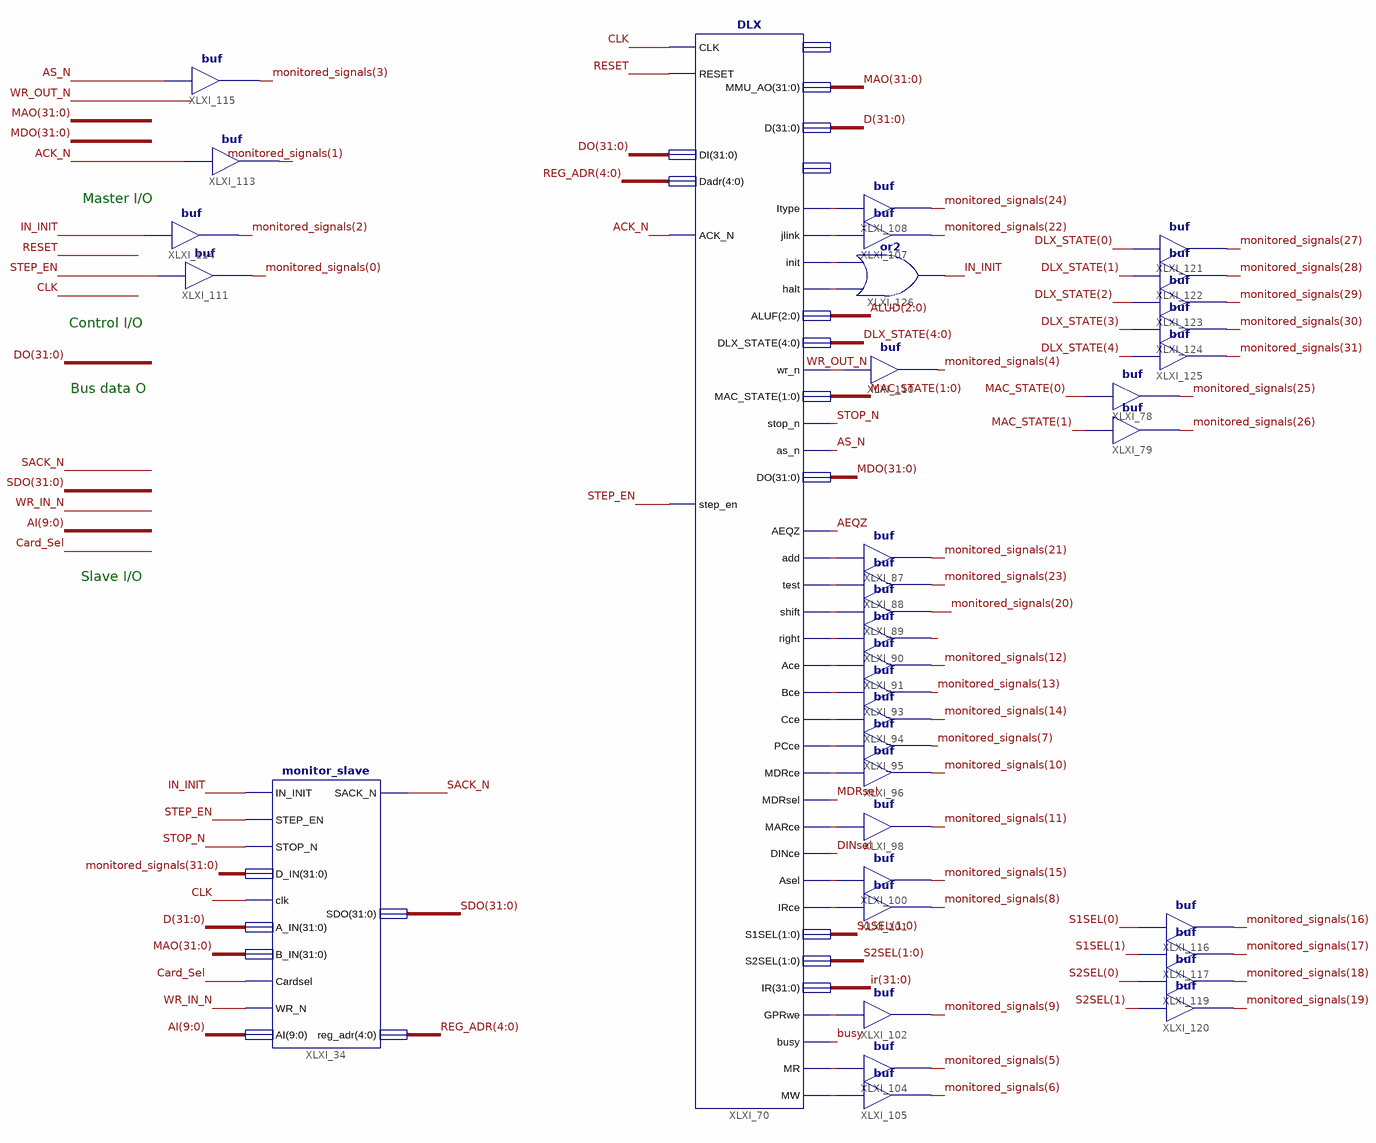
[diagram p0: schematic sheet 1]
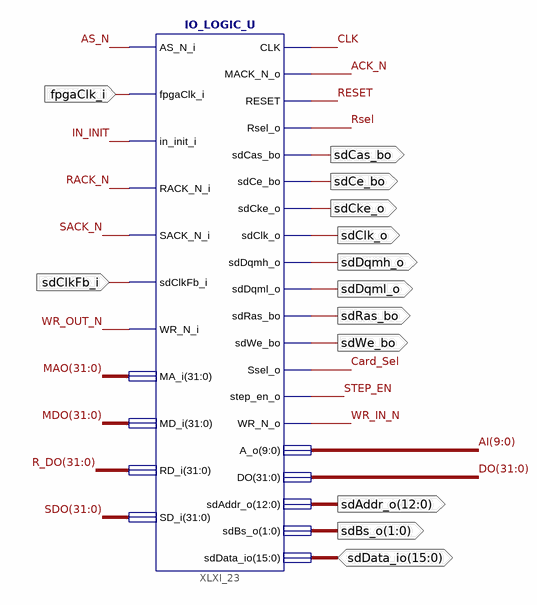
[diagram p1: schematic sheet 2]
// Xilinx ISE schematic Top_Level.sch (spartan6) as structural Verilog: 37 symbols, 13 ports
module Top_Level (
  input  fpgaClk_i,
  input  sdClkFb_i,
  inout  [15:0] sdData_io,
  output sdClk_o,
  output [1:0] sdBs_o,
  output sdDqml_o,
  output sdDqmh_o,
  output sdWe_bo,
  output sdCas_bo,
  output sdRas_bo,
  output sdCe_bo,
  output sdCke_o,
  output [12:0] sdAddr_o
);

  wire ACK_N, AEQZ, AS_N, busy, Card_Sel, CLK, DINsel, IN_INIT, MDRsel, RACK_N, RESET, Rsel, SACK_N, STEP_EN,
       STOP_N, WR_IN_N, WR_OUT_N, XLXN_24, XLXN_25, XLXN_27, XLXN_28, XLXN_29, XLXN_31, XLXN_33, XLXN_34,
       XLXN_35, XLXN_36, XLXN_37, XLXN_38, XLXN_39, XLXN_40, XLXN_41, XLXN_45, XLXN_46, XLXN_48, XLXN_61,
       XLXN_63;
  wire [1:0] MAC_STATE, S1SEL, S2SEL;
  wire [2:0] ALUD;
  wire [4:0] DLX_STATE, REG_ADR;
  wire [9:0] AI;
  wire [31:0] D, DO, ir, MAO, MDO, monitored_signals, R_DO, SDO;

  IO_LOGIC_U XLXI_23 (
    .AS_N_i(AS_N), .fpgaClk_i(fpgaClk_i), .in_init_i(IN_INIT), .RACK_N_i(RACK_N), .SACK_N_i(SACK_N),
    .sdClkFb_i(sdClkFb_i), .WR_N_i(WR_OUT_N), .MA_i(MAO), .MD_i(MDO), .RD_i(R_DO), .SD_i(SDO), .CLK(CLK),
    .MACK_N_o(ACK_N), .RESET(RESET), .Rsel_o(Rsel), .sdCas_bo(sdCas_bo), .sdCe_bo(sdCe_bo),
    .sdCke_o(sdCke_o), .sdClk_o(sdClk_o), .sdDqmh_o(sdDqmh_o), .sdDqml_o(sdDqml_o), .sdRas_bo(sdRas_bo),
    .sdWe_bo(sdWe_bo), .Ssel_o(Card_Sel), .step_en_o(STEP_EN), .WR_N_o(WR_IN_N), .A_o(AI), .DO(DO),
    .sdAddr_o(sdAddr_o), .sdBs_o(sdBs_o), .sdData_io(sdData_io));
  DLX XLXI_70 (
    .CLK(CLK), .RESET(RESET), .DI(DO), .Dadr(REG_ADR), .step_en(STEP_EN), .ACK_N(ACK_N), .AEQZ(AEQZ),
    .add(XLXN_41), .test(XLXN_40), .shift(XLXN_39), .right(XLXN_38), .Ace(XLXN_37), .Bce(XLXN_36),
    .Cce(XLXN_35), .PCce(XLXN_34), .MDRce(XLXN_33), .MDRsel(MDRsel), .MARce(XLXN_31), .DINce(DINsel),
    .Asel(XLXN_28), .IRce(XLXN_29), .MMU_AO(MAO), .D(D), .S1SEL(S1SEL), .S2SEL(S2SEL), .Itype(XLXN_45),
    .jlink(XLXN_46), .init(XLXN_63), .halt(XLXN_48), .ALUF(ALUD), .DLX_STATE(DLX_STATE), .wr_n(WR_OUT_N),
    .MAC_STATE(MAC_STATE), .stop_n(STOP_N), .as_n(AS_N), .DO(MDO), .IR(ir), .GPRwe(XLXN_27), .busy(busy),
    .MR(XLXN_25), .MW(XLXN_24));  // open: func, opcode
  buf XLXI_78 (monitored_signals[25], MAC_STATE[0]);
  buf XLXI_79 (monitored_signals[26], MAC_STATE[1]);
  buf XLXI_87 (monitored_signals[21], XLXN_41);
  buf XLXI_88 (monitored_signals[23], XLXN_40);
  buf XLXI_89 (monitored_signals[20], XLXN_39);
  buf XLXI_90 (XLXN_61, XLXN_38);
  buf XLXI_91 (monitored_signals[12], XLXN_37);
  buf XLXI_93 (monitored_signals[13], XLXN_36);
  buf XLXI_94 (monitored_signals[14], XLXN_35);
  buf XLXI_95 (monitored_signals[7], XLXN_34);
  buf XLXI_96 (monitored_signals[10], XLXN_33);
  buf XLXI_98 (monitored_signals[11], XLXN_31);
  buf XLXI_100 (monitored_signals[15], XLXN_28);
  buf XLXI_101 (monitored_signals[8], XLXN_29);
  buf XLXI_102 (monitored_signals[9], XLXN_27);
  buf XLXI_104 (monitored_signals[5], XLXN_25);
  buf XLXI_105 (monitored_signals[6], XLXN_24);
  buf XLXI_107 (monitored_signals[22], XLXN_46);
  buf XLXI_108 (monitored_signals[24], XLXN_45);
  buf XLXI_110 (monitored_signals[4], WR_OUT_N);
  buf XLXI_111 (monitored_signals[0], STEP_EN);
  buf XLXI_113 (monitored_signals[1], ACK_N);
  buf XLXI_114 (monitored_signals[2], IN_INIT);
  buf XLXI_115 (monitored_signals[3], AS_N);
  buf XLXI_116 (monitored_signals[16], S1SEL[0]);
  buf XLXI_117 (monitored_signals[17], S1SEL[1]);
  buf XLXI_119 (monitored_signals[18], S2SEL[0]);
  buf XLXI_120 (monitored_signals[19], S2SEL[1]);
  buf XLXI_121 (monitored_signals[27], DLX_STATE[0]);
  buf XLXI_122 (monitored_signals[28], DLX_STATE[1]);
  buf XLXI_123 (monitored_signals[29], DLX_STATE[2]);
  buf XLXI_124 (monitored_signals[30], DLX_STATE[3]);
  buf XLXI_125 (monitored_signals[31], DLX_STATE[4]);
  monitor_slave XLXI_34 (
    .IN_INIT(IN_INIT), .STEP_EN(STEP_EN), .STOP_N(STOP_N), .D_IN(monitored_signals), .clk(CLK), .A_IN(D),
    .B_IN(MAO), .Cardsel(Card_Sel), .WR_N(WR_IN_N), .AI(AI), .SACK_N(SACK_N), .SDO(SDO), .reg_adr(REG_ADR));
  or XLXI_126 (IN_INIT, XLXN_48, XLXN_63);

  // Notes on the sheet:
  //   Master I/O
  //   Control I/O
  //   Bus data O
  //   Slave I/O
endmodule
